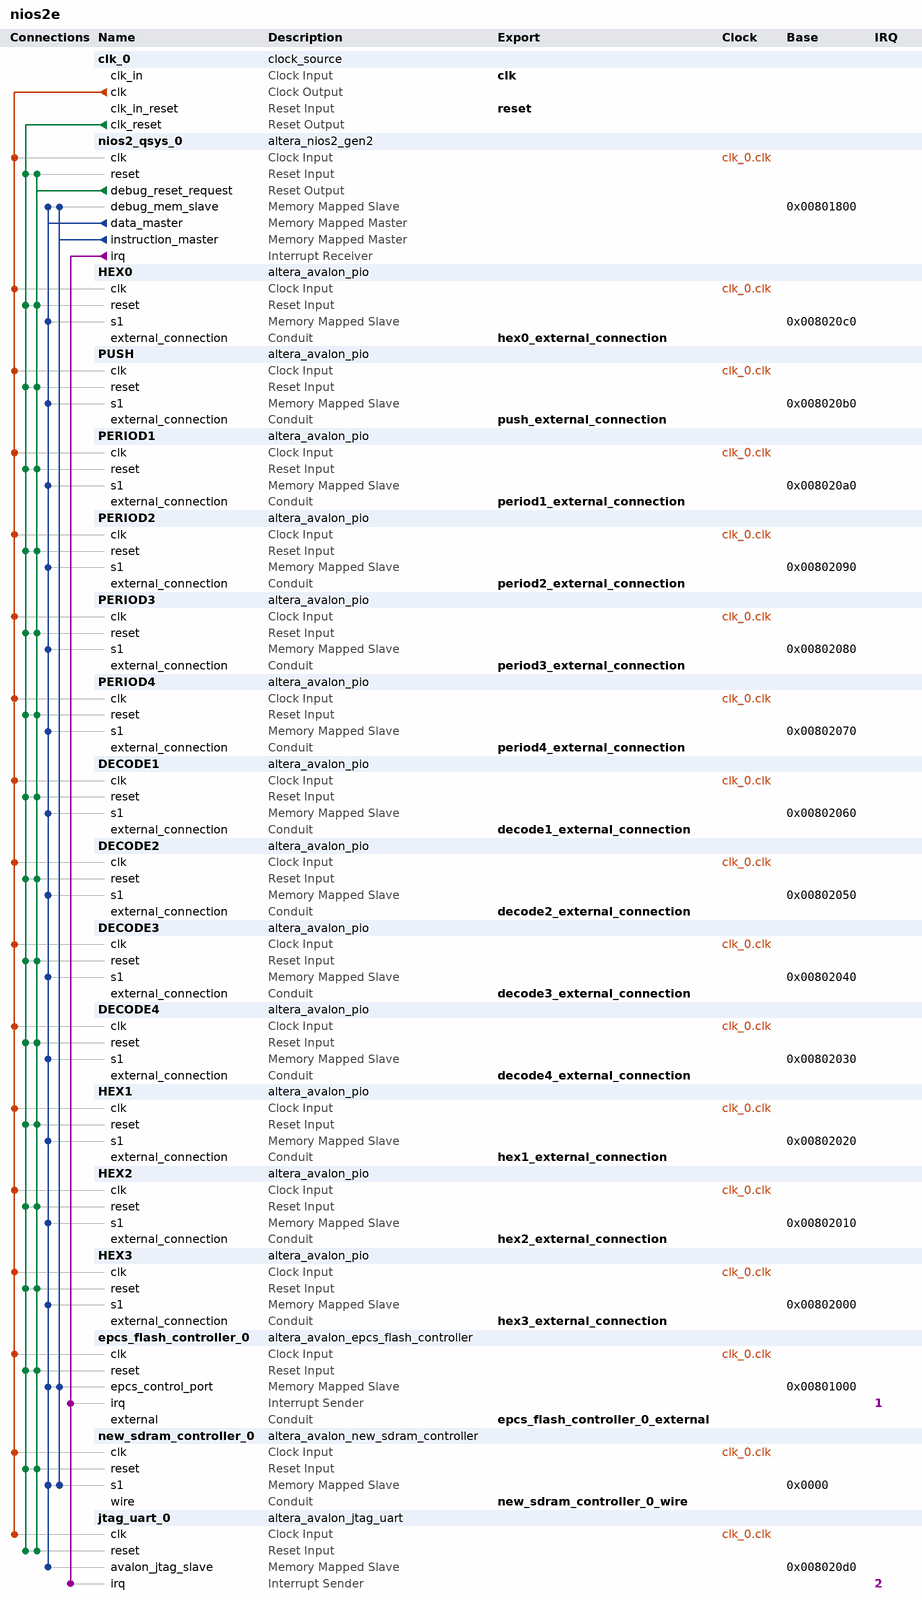
[diagram p0: system contents]
# Platform Designer (Qsys) system nios2e, Cyclone IV E EP4CE6E22C8
# Parameters at their usual value, and those the tool derives, are not listed.
package require -exact qsys 18.1
create_system nios2e
set_project_property DEVICE_FAMILY {Cyclone IV E}
set_project_property DEVICE EP4CE6E22C8

add_instance clk_0 clock_source 18.1
set_instance_parameter_value clk_0 clockFrequency 50000000

add_instance nios2_qsys_0 altera_nios2_gen2 18.1
set_instance_parameter_value nios2_qsys_0 dcache_size 2048
set_instance_parameter_value nios2_qsys_0 exceptionSlave new_sdram_controller_0.s1
set_instance_parameter_value nios2_qsys_0 icache_size 4096
set_instance_parameter_value nios2_qsys_0 impl Tiny
set_instance_parameter_value nios2_qsys_0 resetSlave new_sdram_controller_0.s1
set_instance_parameter_value nios2_qsys_0 setting_activateTrace true

add_instance HEX0 altera_avalon_pio 18.1
set_instance_parameter_value HEX0 direction Output
set_instance_parameter_value HEX0 width 8

add_instance PUSH altera_avalon_pio 18.1
set_instance_parameter_value PUSH direction Input
set_instance_parameter_value PUSH width 4

add_instance PERIOD1 altera_avalon_pio 18.1
set_instance_parameter_value PERIOD1 direction Output
set_instance_parameter_value PERIOD1 width 28

add_instance PERIOD2 altera_avalon_pio 18.1
set_instance_parameter_value PERIOD2 direction Output
set_instance_parameter_value PERIOD2 width 28

add_instance PERIOD3 altera_avalon_pio 18.1
set_instance_parameter_value PERIOD3 direction Output
set_instance_parameter_value PERIOD3 width 28

add_instance PERIOD4 altera_avalon_pio 18.1
set_instance_parameter_value PERIOD4 direction Output
set_instance_parameter_value PERIOD4 width 28

add_instance DECODE1 altera_avalon_pio 18.1
set_instance_parameter_value DECODE1 direction Output
set_instance_parameter_value DECODE1 width 28

add_instance DECODE2 altera_avalon_pio 18.1
set_instance_parameter_value DECODE2 direction Output
set_instance_parameter_value DECODE2 width 28

add_instance DECODE3 altera_avalon_pio 18.1
set_instance_parameter_value DECODE3 direction Output
set_instance_parameter_value DECODE3 width 28

add_instance DECODE4 altera_avalon_pio 18.1
set_instance_parameter_value DECODE4 direction Output
set_instance_parameter_value DECODE4 width 28

add_instance HEX1 altera_avalon_pio 18.1
set_instance_parameter_value HEX1 direction Output
set_instance_parameter_value HEX1 width 8

add_instance HEX2 altera_avalon_pio 18.1
set_instance_parameter_value HEX2 direction Output
set_instance_parameter_value HEX2 width 8

add_instance HEX3 altera_avalon_pio 18.1
set_instance_parameter_value HEX3 direction Output
set_instance_parameter_value HEX3 width 8

add_instance epcs_flash_controller_0 altera_avalon_epcs_flash_controller 18.1
set_instance_parameter_value epcs_flash_controller_0 resetrequest_enabled true

add_instance new_sdram_controller_0 altera_avalon_new_sdram_controller 18.1
set_instance_parameter_value new_sdram_controller_0 TAC 5.5
set_instance_parameter_value new_sdram_controller_0 TRCD 20.0
set_instance_parameter_value new_sdram_controller_0 TRP 20.0
set_instance_parameter_value new_sdram_controller_0 casLatency 3
set_instance_parameter_value new_sdram_controller_0 columnWidth 8
set_instance_parameter_value new_sdram_controller_0 dataWidth 16
set_instance_parameter_value new_sdram_controller_0 generateSimulationModel false
set_instance_parameter_value new_sdram_controller_0 model single_Micron_MT48LC4M32B2_7_chip
set_instance_parameter_value new_sdram_controller_0 numberOfBanks 4
set_instance_parameter_value new_sdram_controller_0 numberOfChipSelects 1
set_instance_parameter_value new_sdram_controller_0 powerUpDelay 100.0
set_instance_parameter_value new_sdram_controller_0 refreshPeriod 15.625
set_instance_parameter_value new_sdram_controller_0 rowWidth 12

add_instance jtag_uart_0 altera_avalon_jtag_uart 18.1
set_instance_parameter_value jtag_uart_0 simInteractiveOptions NO_INTERACTIVE_WINDOWS

# connections
add_connection clk_0.clk DECODE1.clk clock
add_connection clk_0.clk DECODE2.clk clock
add_connection clk_0.clk DECODE3.clk clock
add_connection clk_0.clk DECODE4.clk clock
add_connection clk_0.clk epcs_flash_controller_0.clk clock
add_connection clk_0.clk HEX0.clk clock
add_connection clk_0.clk HEX1.clk clock
add_connection clk_0.clk HEX2.clk clock
add_connection clk_0.clk HEX3.clk clock
add_connection clk_0.clk jtag_uart_0.clk clock
add_connection clk_0.clk new_sdram_controller_0.clk clock
add_connection clk_0.clk nios2_qsys_0.clk clock
add_connection clk_0.clk PERIOD1.clk clock
add_connection clk_0.clk PERIOD2.clk clock
add_connection clk_0.clk PERIOD3.clk clock
add_connection clk_0.clk PERIOD4.clk clock
add_connection clk_0.clk PUSH.clk clock
add_connection clk_0.clk_reset DECODE1.reset reset
add_connection clk_0.clk_reset DECODE2.reset reset
add_connection clk_0.clk_reset DECODE3.reset reset
add_connection clk_0.clk_reset DECODE4.reset reset
add_connection clk_0.clk_reset epcs_flash_controller_0.reset reset
add_connection clk_0.clk_reset HEX0.reset reset
add_connection clk_0.clk_reset HEX1.reset reset
add_connection clk_0.clk_reset HEX2.reset reset
add_connection clk_0.clk_reset HEX3.reset reset
add_connection clk_0.clk_reset jtag_uart_0.reset reset
add_connection clk_0.clk_reset new_sdram_controller_0.reset reset
add_connection clk_0.clk_reset nios2_qsys_0.reset reset
add_connection clk_0.clk_reset PERIOD1.reset reset
add_connection clk_0.clk_reset PERIOD2.reset reset
add_connection clk_0.clk_reset PERIOD3.reset reset
add_connection clk_0.clk_reset PERIOD4.reset reset
add_connection clk_0.clk_reset PUSH.reset reset
add_connection nios2_qsys_0.debug_reset_request DECODE1.reset reset
add_connection nios2_qsys_0.debug_reset_request DECODE2.reset reset
add_connection nios2_qsys_0.debug_reset_request DECODE3.reset reset
add_connection nios2_qsys_0.debug_reset_request DECODE4.reset reset
add_connection nios2_qsys_0.debug_reset_request epcs_flash_controller_0.reset reset
add_connection nios2_qsys_0.debug_reset_request HEX0.reset reset
add_connection nios2_qsys_0.debug_reset_request HEX1.reset reset
add_connection nios2_qsys_0.debug_reset_request HEX2.reset reset
add_connection nios2_qsys_0.debug_reset_request HEX3.reset reset
add_connection nios2_qsys_0.debug_reset_request jtag_uart_0.reset reset
add_connection nios2_qsys_0.debug_reset_request new_sdram_controller_0.reset reset
add_connection nios2_qsys_0.debug_reset_request nios2_qsys_0.reset reset
add_connection nios2_qsys_0.debug_reset_request PERIOD1.reset reset
add_connection nios2_qsys_0.debug_reset_request PERIOD2.reset reset
add_connection nios2_qsys_0.debug_reset_request PERIOD3.reset reset
add_connection nios2_qsys_0.debug_reset_request PERIOD4.reset reset
add_connection nios2_qsys_0.debug_reset_request PUSH.reset reset
add_connection nios2_qsys_0.data_master DECODE1.s1 avalon
set_connection_parameter_value nios2_qsys_0.data_master/DECODE1.s1 baseAddress 0x00802060
add_connection nios2_qsys_0.data_master DECODE2.s1 avalon
set_connection_parameter_value nios2_qsys_0.data_master/DECODE2.s1 baseAddress 0x00802050
add_connection nios2_qsys_0.data_master DECODE3.s1 avalon
set_connection_parameter_value nios2_qsys_0.data_master/DECODE3.s1 baseAddress 0x00802040
add_connection nios2_qsys_0.data_master DECODE4.s1 avalon
set_connection_parameter_value nios2_qsys_0.data_master/DECODE4.s1 baseAddress 0x00802030
add_connection nios2_qsys_0.data_master epcs_flash_controller_0.epcs_control_port avalon
set_connection_parameter_value nios2_qsys_0.data_master/epcs_flash_controller_0.epcs_control_port baseAddress 0x00801000
add_connection nios2_qsys_0.data_master HEX0.s1 avalon
set_connection_parameter_value nios2_qsys_0.data_master/HEX0.s1 baseAddress 0x008020c0
add_connection nios2_qsys_0.data_master HEX1.s1 avalon
set_connection_parameter_value nios2_qsys_0.data_master/HEX1.s1 baseAddress 0x00802020
add_connection nios2_qsys_0.data_master HEX2.s1 avalon
set_connection_parameter_value nios2_qsys_0.data_master/HEX2.s1 baseAddress 0x00802010
add_connection nios2_qsys_0.data_master HEX3.s1 avalon
set_connection_parameter_value nios2_qsys_0.data_master/HEX3.s1 baseAddress 0x00802000
add_connection nios2_qsys_0.data_master jtag_uart_0.avalon_jtag_slave avalon
set_connection_parameter_value nios2_qsys_0.data_master/jtag_uart_0.avalon_jtag_slave baseAddress 0x008020d0
add_connection nios2_qsys_0.data_master new_sdram_controller_0.s1 avalon
set_connection_parameter_value nios2_qsys_0.data_master/new_sdram_controller_0.s1 baseAddress 0x0000
add_connection nios2_qsys_0.data_master nios2_qsys_0.debug_mem_slave avalon
set_connection_parameter_value nios2_qsys_0.data_master/nios2_qsys_0.debug_mem_slave baseAddress 0x00801800
add_connection nios2_qsys_0.data_master PERIOD1.s1 avalon
set_connection_parameter_value nios2_qsys_0.data_master/PERIOD1.s1 baseAddress 0x008020a0
add_connection nios2_qsys_0.data_master PERIOD2.s1 avalon
set_connection_parameter_value nios2_qsys_0.data_master/PERIOD2.s1 baseAddress 0x00802090
add_connection nios2_qsys_0.data_master PERIOD3.s1 avalon
set_connection_parameter_value nios2_qsys_0.data_master/PERIOD3.s1 baseAddress 0x00802080
add_connection nios2_qsys_0.data_master PERIOD4.s1 avalon
set_connection_parameter_value nios2_qsys_0.data_master/PERIOD4.s1 baseAddress 0x00802070
add_connection nios2_qsys_0.data_master PUSH.s1 avalon
set_connection_parameter_value nios2_qsys_0.data_master/PUSH.s1 baseAddress 0x008020b0
add_connection nios2_qsys_0.instruction_master epcs_flash_controller_0.epcs_control_port avalon
set_connection_parameter_value nios2_qsys_0.instruction_master/epcs_flash_controller_0.epcs_control_port baseAddress 0x00801000
add_connection nios2_qsys_0.instruction_master new_sdram_controller_0.s1 avalon
set_connection_parameter_value nios2_qsys_0.instruction_master/new_sdram_controller_0.s1 baseAddress 0x0000
add_connection nios2_qsys_0.instruction_master nios2_qsys_0.debug_mem_slave avalon
set_connection_parameter_value nios2_qsys_0.instruction_master/nios2_qsys_0.debug_mem_slave baseAddress 0x00801800
add_connection nios2_qsys_0.irq epcs_flash_controller_0.irq interrupt
set_connection_parameter_value nios2_qsys_0.irq/epcs_flash_controller_0.irq irqNumber 1
add_connection nios2_qsys_0.irq jtag_uart_0.irq interrupt
set_connection_parameter_value nios2_qsys_0.irq/jtag_uart_0.irq irqNumber 2

# exported interfaces
add_interface clk clock sink
set_interface_property clk EXPORT_OF clk_0.clk_in
add_interface decode1_external_connection conduit end
set_interface_property decode1_external_connection EXPORT_OF DECODE1.external_connection
add_interface decode2_external_connection conduit end
set_interface_property decode2_external_connection EXPORT_OF DECODE2.external_connection
add_interface decode3_external_connection conduit end
set_interface_property decode3_external_connection EXPORT_OF DECODE3.external_connection
add_interface decode4_external_connection conduit end
set_interface_property decode4_external_connection EXPORT_OF DECODE4.external_connection
add_interface epcs_flash_controller_0_external conduit end
set_interface_property epcs_flash_controller_0_external EXPORT_OF epcs_flash_controller_0.external
add_interface hex0_external_connection conduit end
set_interface_property hex0_external_connection EXPORT_OF HEX0.external_connection
add_interface hex1_external_connection conduit end
set_interface_property hex1_external_connection EXPORT_OF HEX1.external_connection
add_interface hex2_external_connection conduit end
set_interface_property hex2_external_connection EXPORT_OF HEX2.external_connection
add_interface hex3_external_connection conduit end
set_interface_property hex3_external_connection EXPORT_OF HEX3.external_connection
add_interface new_sdram_controller_0_wire conduit end
set_interface_property new_sdram_controller_0_wire EXPORT_OF new_sdram_controller_0.wire
add_interface period1_external_connection conduit end
set_interface_property period1_external_connection EXPORT_OF PERIOD1.external_connection
add_interface period2_external_connection conduit end
set_interface_property period2_external_connection EXPORT_OF PERIOD2.external_connection
add_interface period3_external_connection conduit end
set_interface_property period3_external_connection EXPORT_OF PERIOD3.external_connection
add_interface period4_external_connection conduit end
set_interface_property period4_external_connection EXPORT_OF PERIOD4.external_connection
add_interface push_external_connection conduit end
set_interface_property push_external_connection EXPORT_OF PUSH.external_connection
add_interface reset reset sink
set_interface_property reset EXPORT_OF clk_0.clk_in_reset

set_interconnect_requirement {$system} qsys_mm.clockCrossingAdapter HANDSHAKE
set_interconnect_requirement {$system} qsys_mm.maxAdditionalLatency 1

save_system nios2e.qsys
